# Altium schematic sheet Power_Management.SchDoc
size A3; ApprovedBy: Mustafa Atılay Beycan; CheckedBy: Mustafa Atılay Beycan; Author: Mustafa Atılay Beycan; CompanyName: Mustafa Atılay Beycan; DrawnBy: Mustafa Atılay Beycan; Engineer: Mustafa Atılay Beycan; Organization: Mustafa Atılay Beycan; SheetNumber: 4; SheetTotal: 8; FilePath: https://github.com/mustafaatilay/Outdoor-Tracking-Project
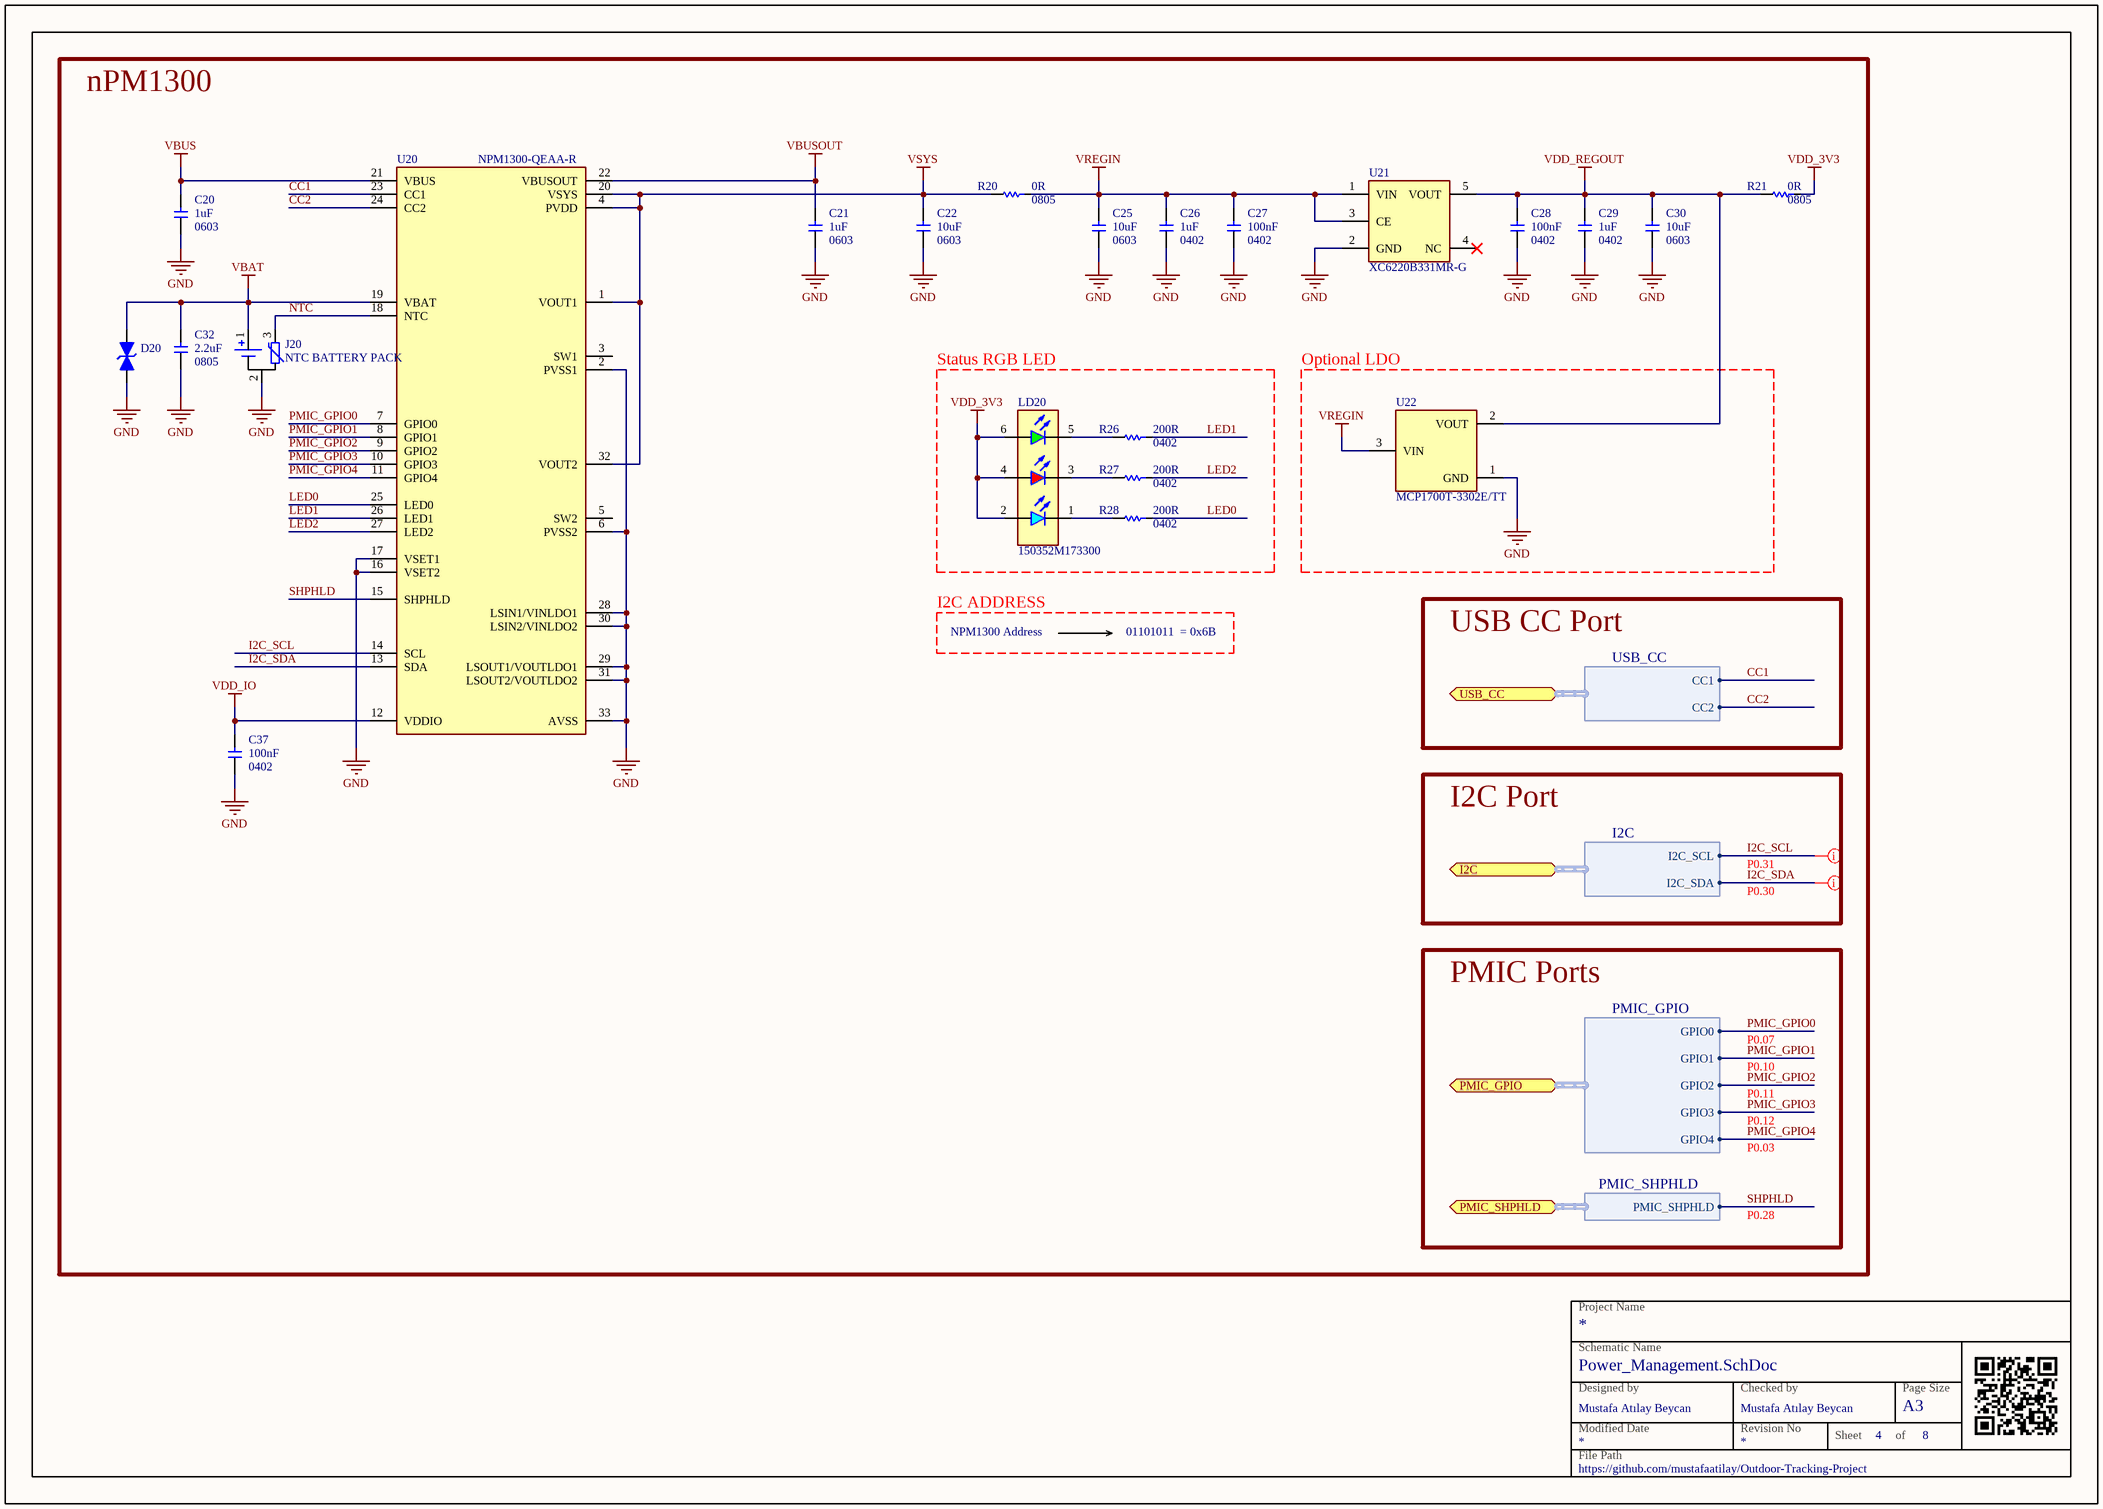
[diagram p0: Power_Management.SchDoc]

## Parts
C20  Capacitance: 1uF  Package: 0603  [CAP 0603]  (hidden comment: 1uF 10% X7R 16V 0603 SMD)
C21  Capacitance: 1uF  Package: 0603  [CAP 0603]  (hidden comment: 1uF 10% X7R 16V 0603 SMD)
C22  Capacitance: 10uF  Package: 0603  [CAP 0603]  (hidden comment: 10uF 20% X5R 25V 0603 SMD)
C25  Capacitance: 10uF  Package: 0603  [CAP 0603]  (hidden comment: 10uF 20% X5R 25V 0603 SMD)
C26  Capacitance: 1uF  Package: 0402  [CAP 0402]  (hidden comment: 1uF 10% X7R 10V 0402 SMD)
C27  Capacitance: 100nF  Package: 0402  [CAP 0402]  (hidden comment: 100nF 10% X7R 10V 0402 SMD)
C28  Capacitance: 100nF  Package: 0402  [CAP 0402]  (hidden comment: 100nF 10% X7R 10V 0402 SMD)
C29  Capacitance: 1uF  Package: 0402  [CAP 0402]  (hidden comment: 1uF 10% X7R 10V 0402 SMD)
C30  Capacitance: 10uF  Package: 0603  [CAP 0603]  (hidden comment: 10uF 20% X5R 25V 0603 SMD)
C32  Capacitance: 2.2uF  Package: 0805  [CAP 0805]  (hidden comment: 2.2uF 10% X7T 100V 0805 SMD)
C37  Capacitance: 100nF  Package: 0402  [CAP 0402]  (hidden comment: 100nF 10% X7R 16V 0402 SMD)
D20  D5V0L1B2WS-7  [DIODE TVS SOD-323]  (value not drawn)
J20  NTC BATTERY PACK  [CONN BATT - 1.25MM 3 PIN]
LD20  150352M173300  [LED RGB 150352M173300]
R20  Resistance: 0R  Package: 0805  [RES 0805]  (hidden comment: 0R 5% * 0805 SMD)
R21  Resistance: 0R  Package: 0805  [RES 0805]  (hidden comment: 0R 5% * 0805 SMD)
R26  Resistance: 200R  Package: 0402  [RES 0402]  (hidden comment: 200R 5% 1/10W 0402 SMD)
R27  Resistance: 200R  Package: 0402  [RES 0402]  (hidden comment: 200R 5% 1/10W 0402 SMD)
R28  Resistance: 200R  Package: 0402  [RES 0402]  (hidden comment: 200R 5% 1/10W 0402 SMD)
U20  NPM1300-QEAA-R  [IC QFN-32 (5X5) EXP]
U21  XC6220B331MR-G  [IC SOT-25]
U22  MCP1700T-3302E/TT  [IC SOT-23-3]

## Blocks framed on the sheet
Status RGB LED: LD20 R26-R28
Optional LDO: U22

## Ports
I2C (bidir, harness I2C), PMIC_GPIO (bidir, harness PMIC_GPIO), PMIC_SHPHLD (bidir, harness PMIC_SHPHLD), USB_CC (bidir, harness USB_CC)

## Harnesses
I2C: I2C_SCL, I2C_SDA
PMIC_GPIO: GPIO0, GPIO1, GPIO2, GPIO3, GPIO4
USB_CC: CC1, CC2
PMIC_SHPHLD: PMIC_SHPHLD

## Nets
GND: C20.2 C21.2 C22.2 C25.2 C26.2 C27.2 C28.2 C29.2 C30.2 C32.2 C37.2 D20.1 J20.2 U20.2(PVSS1) U20.6(PVSS2) U20.16(VSET2) U20.17(VSET1) U20.28(LSIN1/VINLDO1) U20.29(LSOUT1/VOUTLDO1) U20.30(LSIN2/VINLDO2) U20.31(LSOUT2/VOUTLDO2) U20.33(AVSS) U21.2(GND) U22.1(GND)
VBAT: C32.1 D20.2 J20.1 U20.19(VBAT)
VBUS: C20.1 U20.21(VBUS)
VBUSOUT: C21.1 U20.22(VBUSOUT)
VDD_3V3: LD20.2(A) LD20.4(A) LD20.6(A) R21.1
VDD_IO: C37.1 U20.12(VDDIO)
VDD_REGOUT: C28.1 C29.1 C30.1 R21.2 U21.5(VOUT) U22.2(VOUT)
VREGIN: C25.1 C26.1 C27.1 R20.1 U21.1(VIN) U21.3(CE) U22.3(VIN)
VSYS: C22.1 R20.2 U20.1(VOUT1) U20.4(PVDD) U20.20(VSYS) U20.32(VOUT2)
CC1: U20.23(CC1) ; port USB_CC.CC1
CC2: U20.24(CC2) ; port USB_CC.CC2
I2C_SCL: U20.14(SCL) ; port I2C.I2C_SCL
I2C_SDA: U20.13(SDA) ; port I2C.I2C_SDA
LED0: R28.1 U20.25(LED0)
LED1: R26.1 U20.26(LED1)
LED2: R27.1 U20.27(LED2)
NTC: J20.3 U20.18(NTC)
PMIC_GPIO0: U20.7(GPIO0) ; port PMIC_GPIO.GPIO0
PMIC_GPIO1: U20.8(GPIO1) ; port PMIC_GPIO.GPIO1
PMIC_GPIO2: U20.9(GPIO2) ; port PMIC_GPIO.GPIO2
PMIC_GPIO3: U20.10(GPIO3) ; port PMIC_GPIO.GPIO3
PMIC_GPIO4: U20.11(GPIO4) ; port PMIC_GPIO.GPIO4
SHPHLD: U20.15(SHPHLD) ; port PMIC_SHPHLD.PMIC_SHPHLD
NetLD20_1: LD20.1(K) R28.2
NetLD20_3: LD20.3(K) R27.2
NetLD20_5: LD20.5(K) R26.2

Not connected (* = marked no-connect by the designer): U20 3(SW1) 5(SW2); U21 4(NC)*

## Layout directives
net class I2C: I2C_SCL, I2C_SDA

## Notes on the sheet
- nPM1300
- I2C ADDRESS
- NPM1300 Address
- 01101011  = 0x6B
- USB CC Port
- I2C Port
- P0.31
- P0.30
- PMIC Ports
- P0.07
- P0.10
- P0.11
- P0.12
- P0.03
- P0.28
- Project Name
- Designed by
- Schematic Name
- Checked by
- Page Size
- File Path
- Modified Date
- Revision No
- Sheet
- of
- A3

## Library data of the parts
C20 C21 = CAP 0603 1uF 16V: ALT MALZEME KODU: 1.009.00271; Link: *; Manufacturer: *; Manufacturer Part Number: *; Value: 1uF 10% X7R 16V 0603 SMD; Tolerance: 10%; TemperatureCoefficient: X7R; Mount: SMD; Voltage: 16V
C22 C25 C30 = CAP 0603: CAP 0603 10uF 25V 20%; Link: *; Manufacturer: *; Manufacturer Part Number: *; Value: CAP 0603; Tolerance: 20%; TemperatureCoefficient: X5R; Mount: SMD; ALT MALZEME KODU: *; Voltage: 25V
C26 C29 = CAP 0402 1uF 10V: ALT MALZEME KODU: 1.009.00838; Link: *; Manufacturer: *; Manufacturer Part Number: *; Value: 1uF 10% X7R 10V 0402 SMD; Tolerance: 10%; TemperatureCoefficient: X7R; Mount: SMD; Voltage: 10V
C27 C28 = CAP 0402 100nF 10V: ALT MALZEME KODU: 1.009.00840; Link: *; Manufacturer: *; Manufacturer Part Number: *; Value: 100nF 10% X7R 10V 0402 SMD; Tolerance: 10%; TemperatureCoefficient: X7R; Mount: SMD; Voltage: 10V
C32 = CAP 0805 2.2uF 100V: Manufacturer: Murata Electronics; Manufacturer Part Number: GRT21BD72A225KE13K; Link: https://bit.ly/3Ly0hbg; Value: 2.2uF 10% X7T 100V 0805 SMD; Tolerance: 10%; TemperatureCoefficient: X7T; Mount: SMD; ALT MALZEME KODU: *; Voltage: 100V
C37 = CAP 0402 100nF 16V: ALT MALZEME KODU: 1.009.00275; Link: *; Manufacturer: *; Manufacturer Part Number: *; Value: 100nF 10% X7R 16V 0402 SMD; Tolerance: 10%; TemperatureCoefficient: X7R; Mount: SMD; Voltage: 16V
D20 = TVS D5V0L1B2WS-7: TVS DIODE 5V 14V SOD323; Manufacturer: Diodes Incorporated; Voltage - Reverse Standoff: 5V (Max); Voltage - Clamping: 14V (Max); Current - Peak Pulse: 6A (8/20µs); Power - Peak Pulse: 84W; Capacitance: 15pF @ 1MHz; ALT MALZEME KODU: 1.012.01100; Link: https://bit.ly/3mhJc7p; Manufacturer Part Number: D5V0L1B2WS-7; Mount: SMD; Package: SOD-323
J20 = BATT NTC: 653003117322; Manufacturer: Würth Electronic; Manufacturer Part Number: 653003117322
LD20 = LED RGB 150352M173300: LED RGB CLEAR 6PLCC SMD; Manufacturer: Würth Elektronik; Voltage - Forward (Vf) (Typ): 2V Red, 3.2V Green, 3.2V Blue; Lens Color: Colorless; Color: Red, Green, Blue (RGB); Configuration: Independent; Manufacturer Product Number: 150352M173300; Link: https://bit.ly/4dLumjj
R20 R21 = RES 0805 0R 5%: ALT MALZEME KODU: 1.031.00613; Link: *; Manufacturer: *; Manufacturer Part Number: *; Value: 0R 5% * 0805 SMD; Tolerance: 5%; PowerRating: *; Mount: SMD
R26-R28 = RES 0402 200R 5%: ALT MALZEME KODU: 1.031.00643; Link: *; Manufacturer: *; Manufacturer Part Number: *; Value: 200R 5% 1/10W 0402 SMD; PowerRating: 1/10W; Mount: SMD; Tolerance: 5%
U20 = IC NPM1300-QEAA-R: PMIC (POWER MANAGEMENT IC); Manufacturer: Nordic Semiconductor ASA; Battery Chemistry: Lithium Ion/Polymer; Number of Cells: 1; Fault Protection: Over Current, Over Temperature, Over/Under Voltage; Interface: GPIO, I2C; Link: https://bit.ly/47b68fX; Manufacturer Product Number: NPM1300-QEAA-R; Function: Power Management
U21 = IC XC6220B331MR-G: IC REG LINEAR 3.3V 1A SOT-25; Manufacturer: Torex; Dropout Voltage: 655mV; Min Input Voltage: 1.6V; Max Input Voltage: 6V; Number of Regulators: 1; Min Current Limit: 1.005A; Output Type: Fixed; ALT MALZEME KODU: 1.029.00604; Supplier 1: Digi-Key; Manufacturer Part Number: XC6220B331MR-G; RoHS: Yes; Category: Voltage Regulators - Linear; Stock 1: 41723; Pricing 1: 1=0,96000, 10=0,86000, 25=0,81600, 100=0,67040, 250=0,62672, 500=0,55384, 1000=0,43725 (USD); Mount: Surface Mount; Case/Package: SOT-25; Number of Pins: 5; Min Operating Temperature: -40°C; Max Operating Temperature: 85°C; Package Quantity: 1; Packaging: Tape and Reel; Output Current: 1A; Output Voltage: 3.3V; Nominal Output Voltage: 3.3V; Series: -; REACH SVHC: No SVHC; RoHS Compliant: Yes; ComponentLink1URL: https://datasheet.ciiva.com/7992/610888-7992813.pdf?src-supplier=Element14; ComponentLink1Description: https://datasheet.ciiva.com/7992/610888-7992813.pdf?src-supplier=Element14; ComponentLink2URL: https://datasheet.ciiva.com/5755/610888-5755886.pdf?src-supplier=Farnell; ComponentLink2Description: https://datasheet.ciiva.com/5755/610888-5755886.pdf?src-supplier=Farnell; ComponentLink3URL: https://datasheet.ciiva.com/2040/xc6220-2040201.pdf?src-supplier=Digi-Key; ComponentLink3Description: https://datasheet.ciiva.com/2040/xc6220-2040201.pdf?src-supplier=Digi-Key; ComponentLink4URL: https://datasheet.ciiva.com/2040/xc6220-2040200.pdf?src-supplier=Digi-Key; ComponentLink4Description: https://datasheet.ciiva.com/2040/xc6220-2040200.pdf?src-supplier=Digi-Key; ComponentLink5URL: https://datasheet.ciiva.com/2040/xc6220-2040202.pdf?src-supplier=Digi-Key; ComponentLink5Description: https://datasheet.ciiva.com/2040/xc6220-2040202.pdf?src-supplier=Digi-Key; Supplier Part Number 1: 893-1133-1-ND; Link: https://bit.ly/3DS6BXY
U22 = IC MCP1700T-3302E/TT: IC REG LINEAR 3.3V 250MA SOT23-3; Manufacturer: Microchip Technology; Voltage - Input: 6V (Max); Voltage - Output: 3.3V Fixed; Voltage Dropout: 0.35V @ 250mA; PSRR: 44dB (100Hz); ALT MALZEME KODU: 1.029.00603; Manufacturer Part Number: MCP1700T-3302E/TT; Link: https://bit.ly/3bVx1Ze; Current - Output: 250mA; Package: SOT-23-3; Mount: SMD